# Altium schematic sheet LED1.SchDoc
size A4
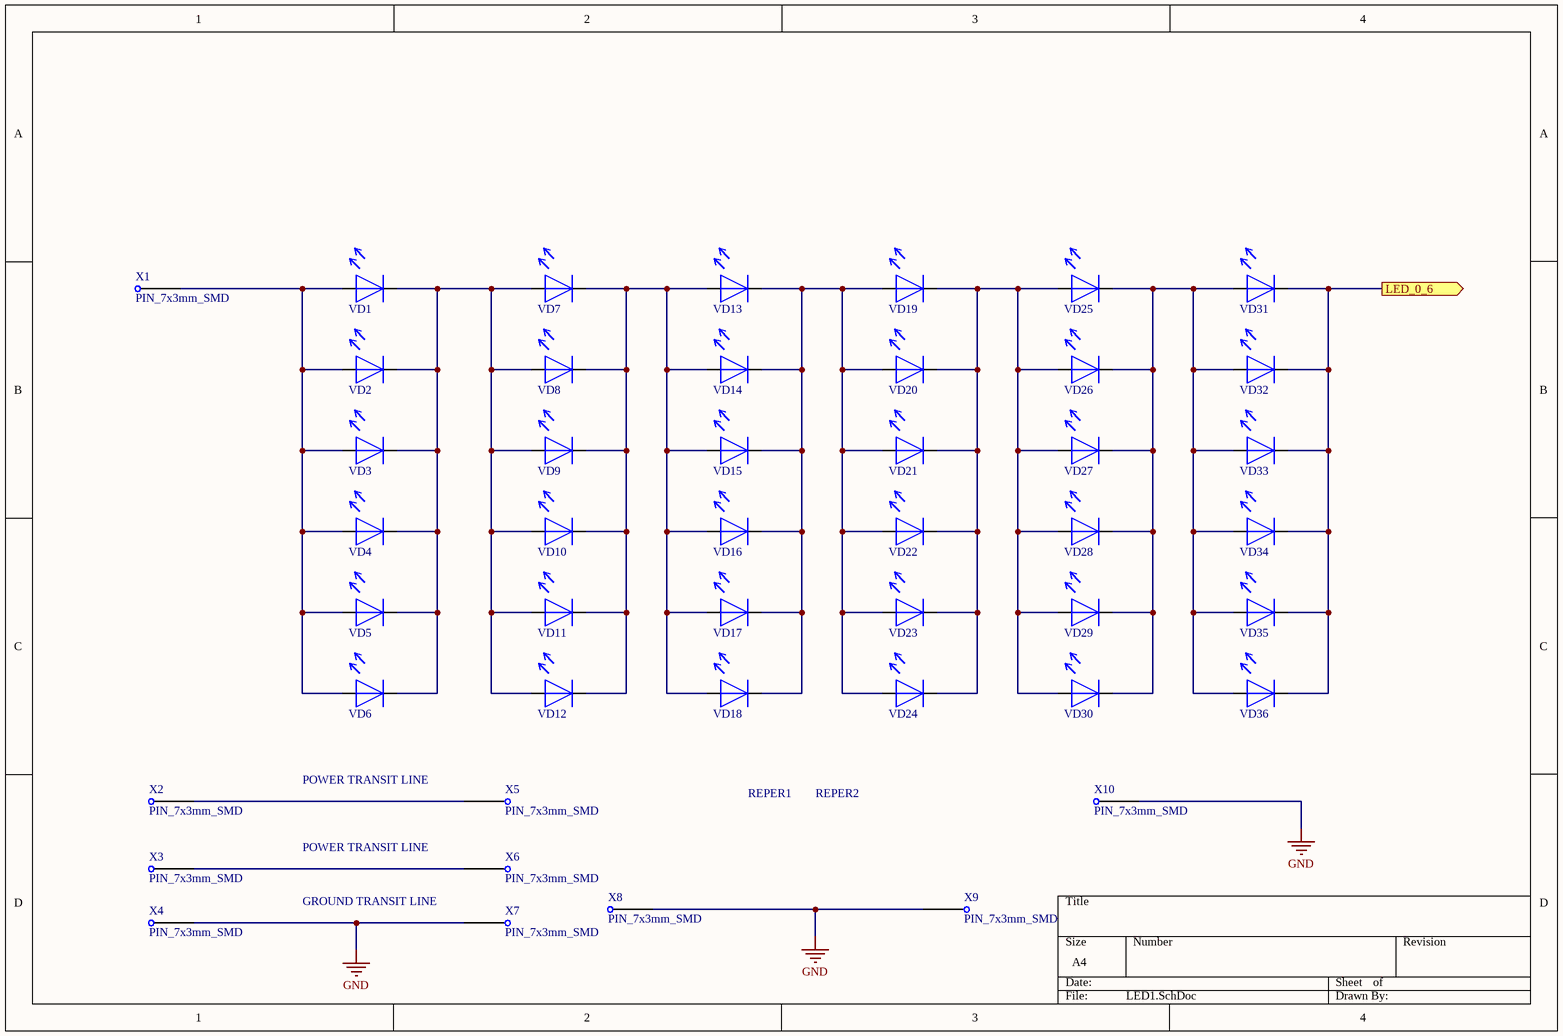
[diagram p0: LED1.SchDoc]

## Parts
1  REPER1  [REPER1.2]
2  REPER2  [REPER1.2]
VD1  SPMWHT541MD5WAT0SB  [LED_Samsung]  (value not drawn)
VD2  SPMWHT541MD5WAT0SB  [LED_Samsung]  (value not drawn)
VD3  SPMWHT541MD5WAT0SB  [LED_Samsung]  (value not drawn)
VD4  SPMWHT541MD5WAT0SB  [LED_Samsung]  (value not drawn)
VD5  SPMWHT541MD5WAT0SB  [LED_Samsung]  (value not drawn)
VD6  SPMWHT541MD5WAT0SB  [LED_Samsung]  (value not drawn)
VD7  SPMWHT541MD5WAT0SB  [LED_Samsung]  (value not drawn)
VD8  SPMWHT541MD5WAT0SB  [LED_Samsung]  (value not drawn)
VD9  SPMWHT541MD5WAT0SB  [LED_Samsung]  (value not drawn)
VD10  SPMWHT541MD5WAT0SB  [LED_Samsung]  (value not drawn)
VD11  SPMWHT541MD5WAT0SB  [LED_Samsung]  (value not drawn)
VD12  SPMWHT541MD5WAT0SB  [LED_Samsung]  (value not drawn)
VD13  SPMWHT541MD5WAT0SB  [LED_Samsung]  (value not drawn)
VD14  SPMWHT541MD5WAT0SB  [LED_Samsung]  (value not drawn)
VD15  SPMWHT541MD5WAT0SB  [LED_Samsung]  (value not drawn)
VD16  SPMWHT541MD5WAT0SB  [LED_Samsung]  (value not drawn)
VD17  SPMWHT541MD5WAT0SB  [LED_Samsung]  (value not drawn)
VD18  SPMWHT541MD5WAT0SB  [LED_Samsung]  (value not drawn)
VD19  SPMWHT541MD5WAT0SB  [LED_Samsung]  (value not drawn)
VD20  SPMWHT541MD5WAT0SB  [LED_Samsung]  (value not drawn)
VD21  SPMWHT541MD5WAT0SB  [LED_Samsung]  (value not drawn)
VD22  SPMWHT541MD5WAT0SB  [LED_Samsung]  (value not drawn)
VD23  SPMWHT541MD5WAT0SB  [LED_Samsung]  (value not drawn)
VD24  SPMWHT541MD5WAT0SB  [LED_Samsung]  (value not drawn)
VD25  SPMWHT541MD5WAT0SB  [LED_Samsung]  (value not drawn)
VD26  SPMWHT541MD5WAT0SB  [LED_Samsung]  (value not drawn)
VD27  SPMWHT541MD5WAT0SB  [LED_Samsung]  (value not drawn)
VD28  SPMWHT541MD5WAT0SB  [LED_Samsung]  (value not drawn)
VD29  SPMWHT541MD5WAT0SB  [LED_Samsung]  (value not drawn)
VD30  SPMWHT541MD5WAT0SB  [LED_Samsung]  (value not drawn)
VD31  SPMWHT541MD5WAT0SB  [LED_Samsung]  (value not drawn)
VD32  SPMWHT541MD5WAT0SB  [LED_Samsung]  (value not drawn)
VD33  SPMWHT541MD5WAT0SB  [LED_Samsung]  (value not drawn)
VD34  SPMWHT541MD5WAT0SB  [LED_Samsung]  (value not drawn)
VD35  SPMWHT541MD5WAT0SB  [LED_Samsung]  (value not drawn)
VD36  SPMWHT541MD5WAT0SB  [LED_Samsung]  (value not drawn)
X1  PIN_7x3mm_SMD  [PIN_7x3mm_SMD]
X2  PIN_7x3mm_SMD  [PIN_7x3mm_SMD]
X3  PIN_7x3mm_SMD  [PIN_7x3mm_SMD]
X4  PIN_7x3mm_SMD  [PIN_7x3mm_SMD]
X5  PIN_7x3mm_SMD  [PIN_7x3mm_SMD]
X6  PIN_7x3mm_SMD  [PIN_7x3mm_SMD]
X7  PIN_7x3mm_SMD  [PIN_7x3mm_SMD]
X8  PIN_7x3mm_SMD  [PIN_7x3mm_SMD]
X9  PIN_7x3mm_SMD  [PIN_7x3mm_SMD]
X10  PIN_7x3mm_SMD  [PIN_7x3mm_SMD]

## Ports
LED_0_6 (out)

## Nets
GND: X4.1 X7.1 X8.1 X9.1 X10.1
LED_0_6: VD31.2 VD32.2 VD33.2 VD34.2 VD35.2 VD36.2 ; port LED_0_6
NetVD1_1: VD1.1 VD2.1 VD3.1 VD4.1 VD5.1 VD6.1 X1.1
NetVD1_2: VD1.2 VD2.2 VD3.2 VD4.2 VD5.2 VD6.2 VD7.1 VD8.1 VD9.1 VD10.1 VD11.1 VD12.1
NetVD7_2: VD7.2 VD8.2 VD9.2 VD10.2 VD11.2 VD12.2 VD13.1 VD14.1 VD15.1 VD16.1 VD17.1 VD18.1
NetVD13_2: VD13.2 VD14.2 VD15.2 VD16.2 VD17.2 VD18.2 VD19.1 VD20.1 VD21.1 VD22.1 VD23.1 VD24.1
NetVD19_2: VD19.2 VD20.2 VD21.2 VD22.2 VD23.2 VD24.2 VD25.1 VD26.1 VD27.1 VD28.1 VD29.1 VD30.1
NetVD25_2: VD25.2 VD26.2 VD27.2 VD28.2 VD29.2 VD30.2 VD31.1 VD32.1 VD33.1 VD34.1 VD35.1 VD36.1
NetX2_1: X2.1 X5.1
NetX3_1: X3.1 X6.1

Not connected (* = marked no-connect by the designer): 1 1; 2 1

## Notes on the sheet
- POWER TRANSIT LINE
- GROUND TRANSIT LINE

## Library data of the parts
1 2 = REPER1.2
  1: Value: REPER1
  2: Value: REPER2
VD1-VD36 = LED SPMWHT541MD5WAT0SB: Value: SPMWHT541MD5WAT0SB